# Altium project Nicla_BME688_ANNA_Project_IITrpr.PrjPcb
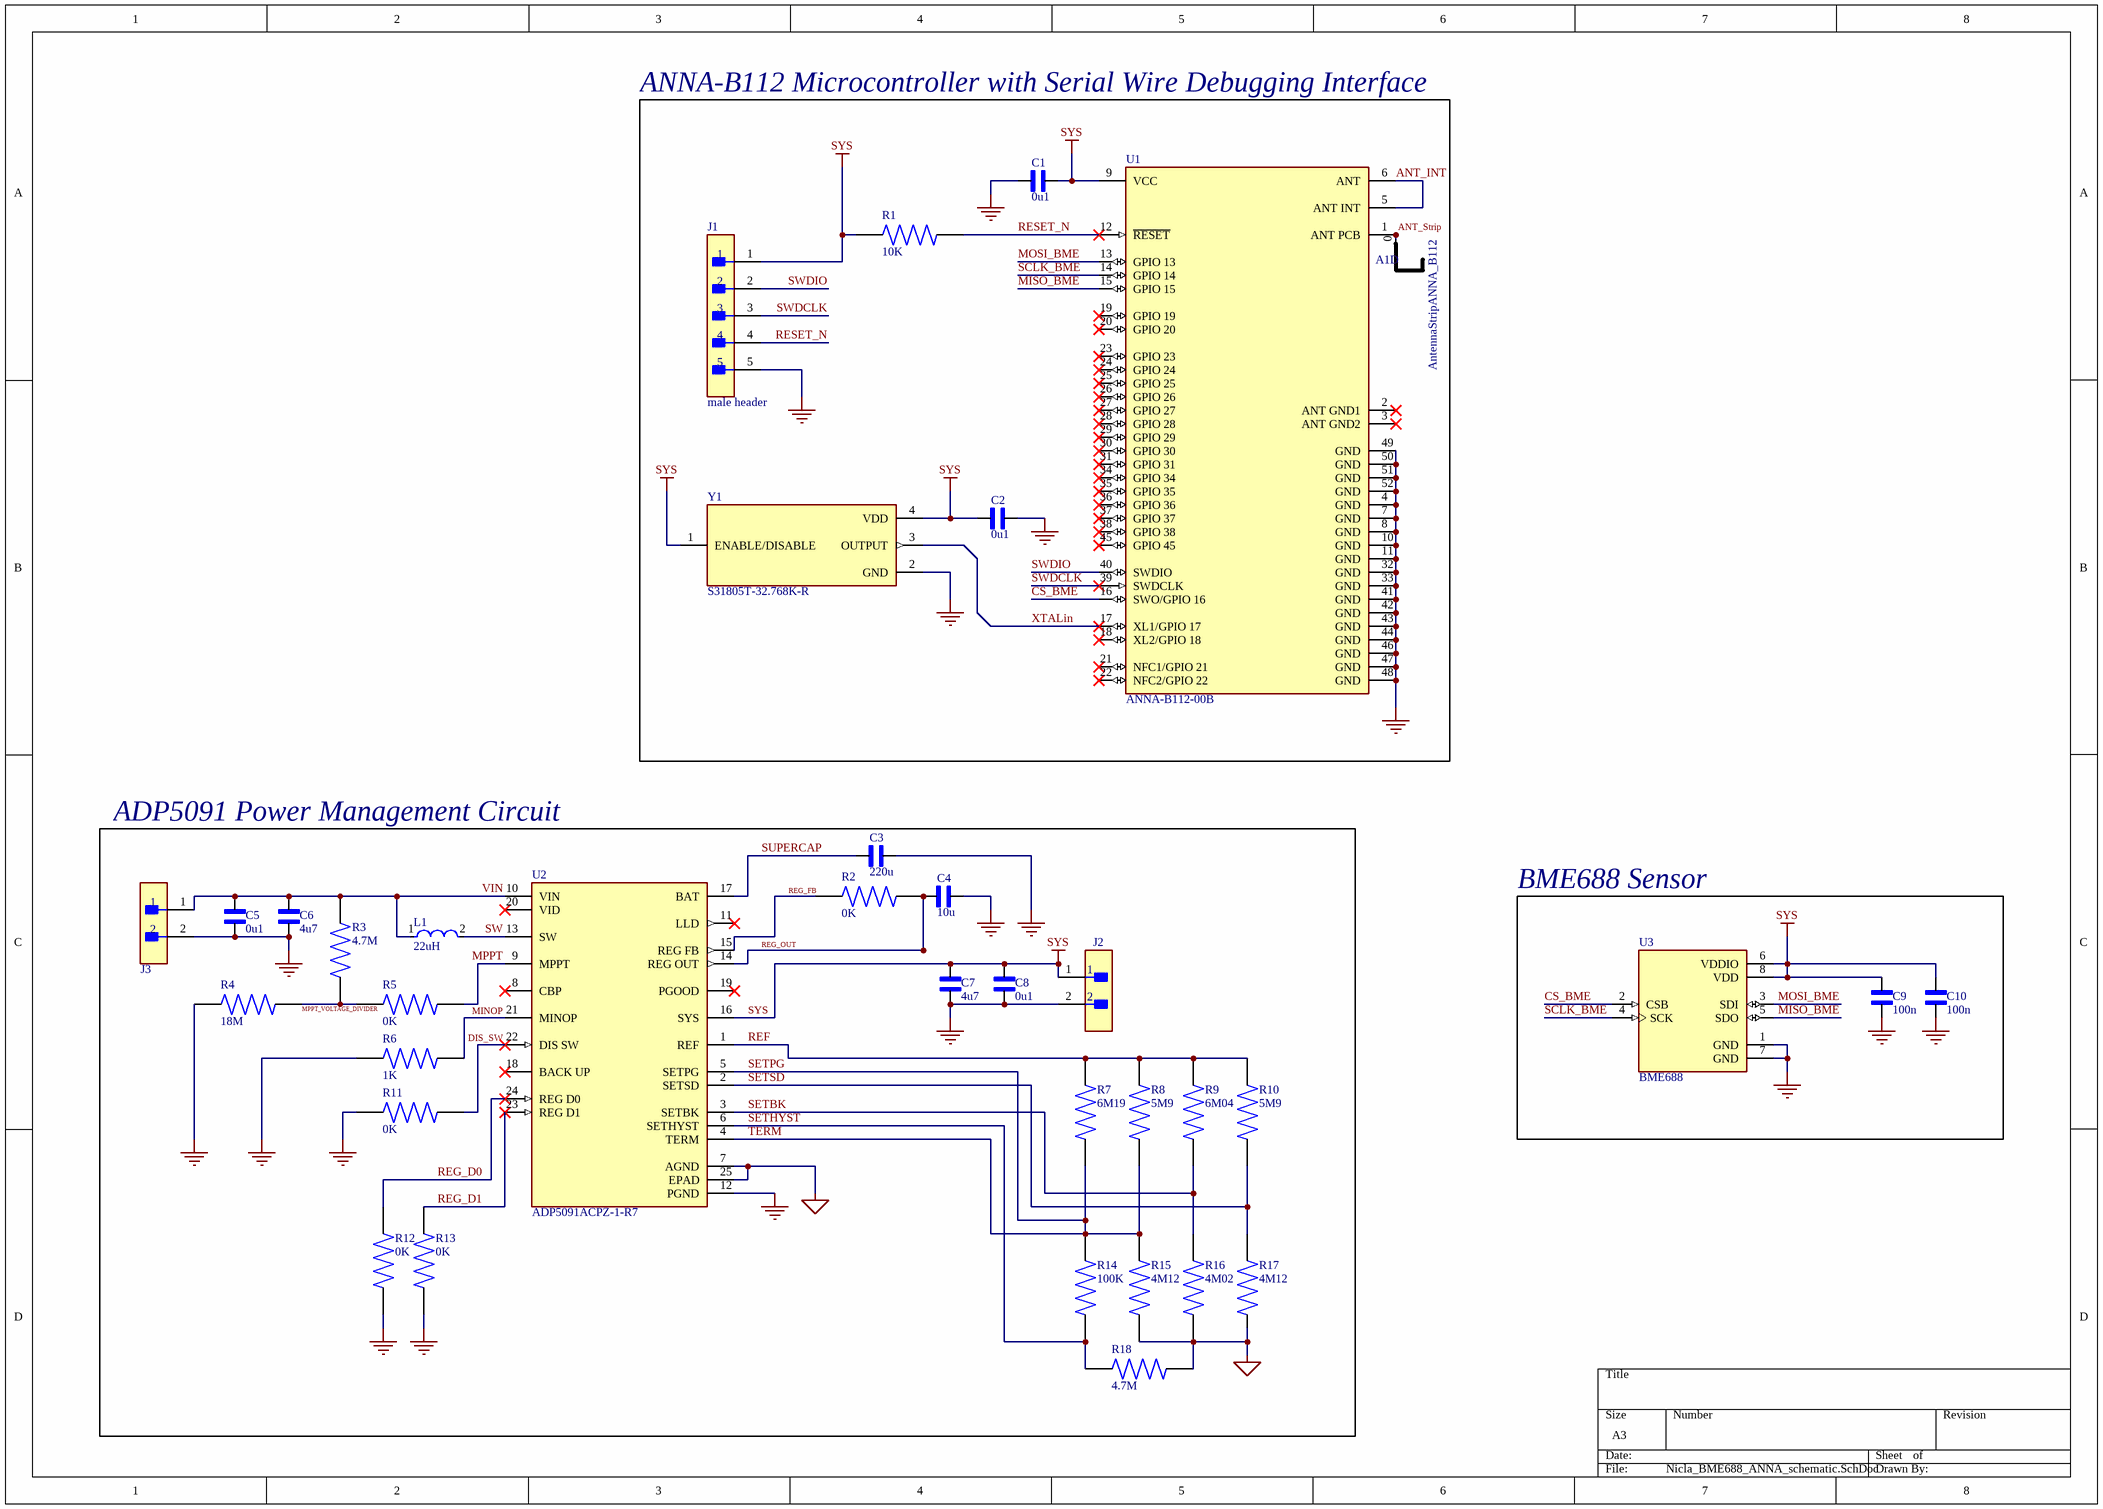
[diagram p0: Nicla_BME688_ANNA_schematic.SchDoc]
1 sheet, 37 parts. Net scope: global (net labels, ports and power ports of the same name join across sheets).
Board file: Nicla_BME688_ANNA_pcb.PcbDoc

## Sheet Nicla_BME688_ANNA_schematic.SchDoc: Ultra Low Power StandAlone BT node
size A3; Author: Udbhav Singh; SheetNumber: 1; SheetTotal: 1

### Parts
A1  AntennaStripANNA_B112  [ChipAntennaANNAB112]  (part D of 4)  (no BOM)
C1  0u1  [CAPC1608X90]
C2  0u1  [CAPC1608X90]
C3  220u  [CAPC3325X152N]
C4  10u  [CAPC1608X90]
C5  0u1  [CAPC1608X90]
C6  4u7  [CAPC1608X90]
C7  4u7  [CAPC1608X90]
C8  0u1  [CAPC1608X90]
C9  100n  [CAPC0603X33N]
C10  100n  [CAPC0603X33N]
J1  male header  [FP-22-28-4050-MFG]  (no BOM)
J2  male header  [FP-TSW-102-12-T-S-MFG]  (value not drawn)  (no BOM)
J3  male header  [FP-TSW-102-12-T-S-MFG]  (value not drawn)  (no BOM)
L1  22uH  [FP-LQH3NPH_ME-MFG]
R1  10K  [RES_ERJU03J682V]
R2  0K  [RES_ERJU03J682V]
R3  4.7M  [RES_ERJU03J682V]
R4  18M  [RES_ERJU03J682V]
R5  0K  [RES_ERJU03J682V]
R6  1K  [RES_ERJU03J682V]
R7  6M19  [RES_ERJU03J682V]
R8  5M9  [RES_ERJU03J682V]
R9  6M04  [RES_ERJU03J682V]
R10  5M9  [RES_ERJU03J682V]
R11  0K  [RES_ERJU03J682V]
R12  0K  [RES_ERJU03J682V]
R13  0K  [RES_ERJU03J682V]
R14  100K  [RES_ERJU03J682V]
R15  4M12  [RES_ERJU03J682V]
R16  4M02  [RES_ERJU03J682V]
R17  4M12  [RES_ERJU03J682V]
R18  4.7M  [RES_ERJU03J682V]
U1  ANNA-B112-00B  [FP-ANNA-B112-00B-0]
U2  ADP5091ACPZ-1-R7  [FP-CP-24-14-IPC_C]
U3  BME688  [IC_BME688]
Y1  S31805T-32.768K-R  [OSC_S31805T-32.768K-R]

### Blocks framed on the sheet
ADP5091 Power Management Circuit: C3-C8 J2 J3 L1 R2-R18 U2
BME688 Sensor: C9 C10 U3

### Nets
GND: C1.1 C2.1 C3.2 C4.1 C5.2 C6.2 C7.2 C8.2 C9.1 C10.1 J1.5 J2.2 J3.2 R4.2 R6.2 R11.2 R12.1 R13.1 R15.2 R16.2 R17.2 R18.2 U1.4(GND) U1.7(GND) U1.8(GND) U1.10(GND) U1.11(GND) U1.32(GND) U1.33(GND) U1.41(GND) U1.42(GND) U1.43(GND) U1.44(GND) U1.46(GND) U1.47(GND) U1.48(GND) U1.49(GND) U1.50(GND) U1.51(GND) U1.52(GND) U2.7(AGND) U2.12(PGND) U2.25(EPAD) U3.1(GND) U3.7(GND) Y1.2(GND)
SYS: C1.2 C2.2 C7.1 C8.1 C9.2 C10.2 J1.1 J2.1 R1.2 U1.9(VCC) U2.16(SYS) U3.6(VDDIO) U3.8(VDD) Y1.1(ENABLE/DISABLE) Y1.4(VDD)
ANT_INT: U1.5(ANT_INT) U1.6(ANT)
ANT_Strip: A1.0 U1.1(ANT_PCB)
CS_BME: U1.16(SWO/GPIO_16) U3.2(CSB)
DIS_SW: R11.1 U2.22(DIS_SW)
MINOP: R6.1 U2.21(MINOP)
MISO_BME: U1.15(GPIO_15) U3.5(SDO)
MOSI_BME: U1.13(GPIO_13) U3.3(SDI)
MPPT: R5.1 U2.9(MPPT)
MPPT_VOLTAGE_DIVIDER: R3.2 R4.1 R5.2
REF: R7.1 R8.1 R9.1 R10.1 U2.1(REF)
REG_D0: R12.2 U2.24(REG_D0)
REG_D1: R13.2 U2.23(REG_D1)
REG_FB: R2.2 U2.15(REG_FB)
REG_OUT: C4.2 R2.1 U2.14(REG_OUT)
RESET_N: J1.4 R1.1 U1.12(~{RESET})
SCLK_BME: U1.14(GPIO_14) U3.4(SCK)
SETBK: R9.2 R16.1 U2.3(SETBK)
SETHYST: R14.2 R18.1 U2.6(SETHYST)
SETPG: R7.2 R8.2 R14.1 R15.1 U2.4(TERM) U2.5(SETPG)  [also labelled TERM]
SETSD: R10.2 R17.1 U2.2(SETSD)
SUPERCAP: C3.1 U2.17(BAT)
SW: L1.2 U2.13(SW)
SWDCLK: J1.3 U1.39(SWDCLK)
SWDIO: J1.2 U1.40(SWDIO)
VIN: C5.1 C6.1 J3.1 L1.1 R3.1 U2.10(VIN)
XTALin: U1.17(XL1/GPIO_17) Y1.3(OUTPUT)

Not connected (* = marked no-connect by the designer): U1 2(ANT_GND1)* 3(ANT_GND2)* 18(XL2/GPIO_18)* 19(GPIO_19)* 20(GPIO_20)* 21(NFC1/GPIO_21)* 22(NFC2/GPIO_22)* 23(GPIO_23)* 24(GPIO_24)* 25(GPIO_25)* 26(GPIO_26)* 27(GPIO_27)* 28(GPIO_28)* 29(GPIO_29)* 30(GPIO_30)* 31(GPIO_31)* 34(GPIO_34)* 35(GPIO_35)* 36(GPIO_36)* 37(GPIO_37)* 38(GPIO_38)* 45(GPIO_45)*; U2 8(CBP)* 11(LLD)* 18(BACK_UP)* 19(PGOOD)* 20(VID)*

### Notes on the sheet
- ANNA-B112 Microcontroller with Serial Wire Debugging Interface

### Library data of the parts
A1 = AntennaStripANNA_B112: Schematic for Antenna Strip for ANNA-B112 INTERNAL Antenna when chip is mounted on corner
C1 C2 C4-C8 = CC0603KRX7R9BB151: 0603; MF: Yageo; SnapEDA_Link: https://www.snapeda.com/parts/CC0603KRX7R9BB151/Yageo/view-part/?ref=snap; Package: 0603 Yageo; Value: *; MP: CC0603KRX7R9BB151; Check_prices: https://www.snapeda.com/parts/CC0603KRX7R9BB151/Yageo/view-part/?ref=eda
C3 = CC0603KRX7R9BB151: 1210; MF: Yageo; SnapEDA_Link: https://www.snapeda.com/parts/CC0603KRX7R9BB151/Yageo/view-part/?ref=snap; Package: 0603 Yageo; Value: *; MP: CC0603KRX7R9BB151; Check_prices: https://www.snapeda.com/parts/CC0603KRX7R9BB151/Yageo/view-part/?ref=eda
C9 C10 = CC0603KRX7R9BB151: 0201; MF: Yageo; SnapEDA_Link: https://www.snapeda.com/parts/CC0603KRX7R9BB151/Yageo/view-part/?ref=snap; Package: 0603 Yageo; Value: *; MP: CC0603KRX7R9BB151; Check_prices: https://www.snapeda.com/parts/CC0603KRX7R9BB151/Yageo/view-part/?ref=eda
J1 = CMP-00257-00278173-1: CONN HEADER VERT 5Pin 2.54MM; NexarPartId: 278173; Voltage Rating: 250V; Number of Contacts: 5; Contact Resistance: 20mΩ; Connector Type: Male Pin; Current Rating: 4A; Glow Wire Compliant: Non-compliant; Max Voltage Rating (DC): 250.25kV; Flammability Rating: UL94 V-0; Min Operating Temperature: 0°C; REACH SVHC: Unknown; Lead Free: Lead Free; Termination: Solder; RoHS: Compliant; Schedule B: 8536694040; Number of Circuits: 5; Mount: Through Hole; Lead Pitch: 2.54mm; Height: 2.29mm; Voltage Rating (DC): 250V; Max Operating Temperature: 75°C; Gender: Male; Pitch: 2.54mm; Width: 2.49mm; Radiation Hardening: No; Contact Plating: Tin; Orientation: Vertical; Length: 12.7mm; Number of Rows: 1; Housing Material: Thermoplastic; Contact Material: Brass; Packaging: Bulk; Contact Mating Length: 6.096mm; Housing Color: Black; Color: Black; Number of Positions: 5
J2 J3 = CMP-02766-001444-1: CONN HEADER VERT 2POS 2.54MM; Number of Contacts: 2; RoHS Compliant: Yes; Gender: Male; Mount: Through Hole; Termination: Solder; Packaging: Bulk; Contact Material: Bronze; Contact Plating: Tin; Number of Rows: 1; REACH SVHC: No SVHC; Pitch: 2.54mm; Radiation Hardening: No
L1 = CMP-06042-009111-1: 1212; DC Resistance (DCR): 480mR; Tolerance: 20%; Current Rating: 860mA; Core Material: Ferrite; Test Frequency: 1MHz; Self Resonant Frequency: 10MHz; Saturation Current: 570mA; Shielding: Shielded; Ratings: AEC-Q200; Resistor Type: Wirewound; Case Code (Imperial): 1212; Packaging: Cut Tape; Inductance: 22uH; Case Code (Metric): 3030; Min Operating Temperature: -40°C; Mount: Surface Mount; Max Operating Temperature: 85°C; Case/Package: 1212
R1-R18 = ERJU02J364X: 0402; MP: ERJU02J364X; Value: *; Package: None; Availability: Unavailable; Price: None
U1 = CMP-207130-000009-1: RF RECEIVER GFSK 2.4GHZ; Manufacturer: U-Blox; Max Supply Voltage: 3.6V; Sensitivity: -91dBm; Min Supply Voltage: 1.7V; Interface: I2C,SPI,UART,I2S; Nominal Supply Current: 3.7mA; Number Of Adc Channels: 8; Transmitting Current: 5.3mA; Number Of Gpio: 25; Receiving Current: 5.4mA; Data Rate: 2Mbits/s; ComponentLink2Description: Datasheet; Manufacturer Part Number: ANNA-B112-00B; Digikey Description: RF RECEIVER GFSK 2.4GHZ; Device Class L1: Integrated Circuits (ICs); Height: 1.25mm; Octopart: https://octopart.com/anna-b112-00b-u-blox-97577862; Temperature: -40°C to +85°C; RoHS: TRUE; Temperature Range Low: -40°C; Max Frequency: 2.4GHz; Device Class L3: Transceivers; Automotive: No; Package: SMD_MD_6MM5_6MM5; Category: UNK; Temperature Range High: +85°C; ComponentLink2URL: https://www.u-blox.com/sites/default/files/ANNA-B112_DataSheet_%28UBX-18011707%29.pdf; Device Class L2: RF Semiconductors and Devices; Lead Free: Yes
U2 = CMP-09132-000010-1: IC BATT CHG MULTI-CHEM 24LFCSP; Manufacturer: Analog Devices Inc.; Output Current: 150mA; Standoff Height: 0.02mm; Max Supply Voltage: 3.3V; Output Voltage: 1.5-3.6V; Nominal Supply Current: 0.51-0.76uA; Min Supply Voltage: 0.08V; Package: CP-24-14; Temperature Range Low: -40°C; Ipc Land Pattern Name: QFN50P400X400X75-24; Device Class L1: Integrated Circuits (ICs); Mouser Description: Ultralow Power Energy Harvester PMU with MPPT and Charge Management; ComponentLink2URL: https://www.analog.com/media/en/technical-documentation/data-sheets/ADP5091-5092.pdf; Height: 0.8mm; Device Class L3: Battery Management; Device Class L2: Power Management ICs; ComponentLink2Description: Datasheet; Octopart: https://octopart.com/adp5091acpz-1-r7-analog+devices-71032930; Temperature: -40°C to +125°C; Automotive: No; Category: IC; Temperature Range High: +125°C; RoHS: TRUE; Manufacturer Part Number: ADP5091ACPZ-1-R7; Lead Free: Yes; Digikey Description: IC BATT CHG MULTI-CHEM 24LFCSP
U3 = BME688: Gas sensor measuring relative humidity, barometric pressure, ambient temperature and gas (VOC); Package: None; MP: BME688; Price: None; Availability: Unavailable; Value: *
Y1 = S31805T-32.768K-R: 32KHz oscillator; Package: None; Price: None; Value: *; MP: S31805T-32.768K-R; Availability: Unavailable